# Altium schematic sheet ESP32C3_VOICE_LED_WS2812B_Sheet.SchDoc: ESP32C3_VOICE_LED
size A4; Author: Hoozz; Organization: Hoozz Play; DocumentNumber: 3; Revision: 1.0; SheetNumber: 3; SheetTotal: 3
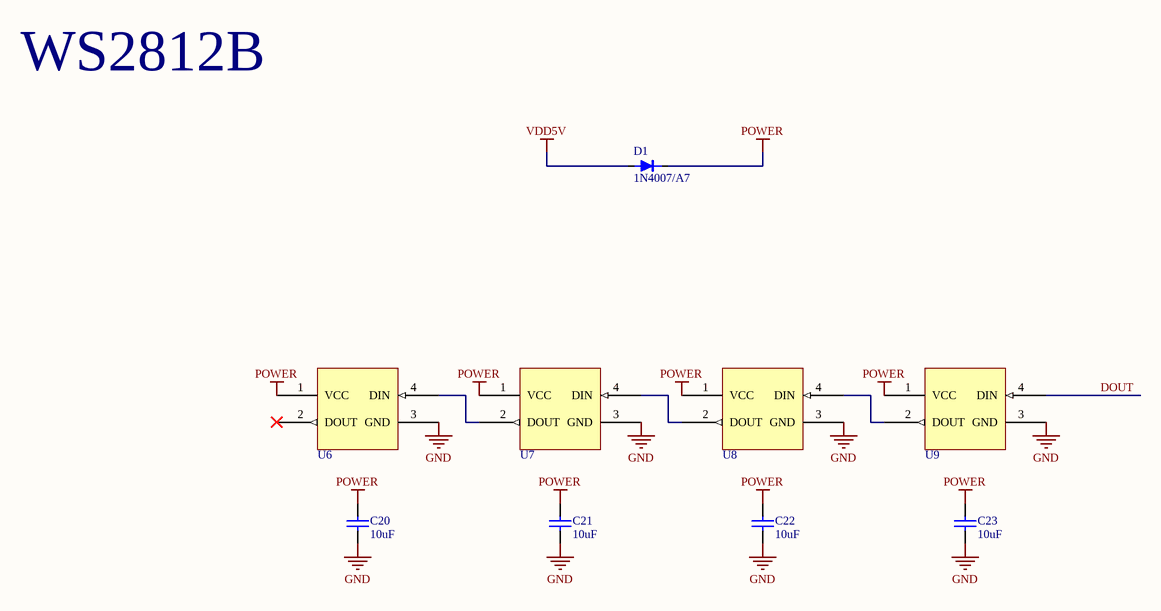
[diagram p0: ESP32C3_VOICE_LED_WS2812B_Sheet.SchDoc]

## Parts
C20  value 10uF  [0603]  (hidden comment: Cap)
C21  value 10uF  [0603]  (hidden comment: Cap)
C22  value 10uF  [0603]  (hidden comment: Cap)
C23  value 10uF  [0603]  (hidden comment: Cap)
D1  1N4007/A7  [SOD-123FL]
U6  WS2812B  [5050]  (value not drawn)
U7  WS2812B  [5050]  (value not drawn)
U8  WS2812B  [5050]  (value not drawn)
U9  WS2812B  [5050]  (value not drawn)

## Nets
GND: C20.2 C21.2 C22.2 C23.2 U6.3(GND) U7.3(GND) U8.3(GND) U9.3(GND)
POWER: C20.1 C21.1 C22.1 C23.1 D1.K U6.1(VCC) U7.1(VCC) U8.1(VCC) U9.1(VCC)
VDD5V: D1.A
DOUT: U9.4(DIN)
NetU6_4: U6.4(DIN) U7.2(DOUT)
NetU7_4: U7.4(DIN) U8.2(DOUT)
NetU8_4: U8.4(DIN) U9.2(DOUT)

Not connected (* = marked no-connect by the designer): U6 2(DOUT)*

## Notes on the sheet
- WS2812B
- Title
- Size:
- Date:
- Author:
- A4
- Number:
- Time:
- Revision:
- Sheet
- of
- File:

## Library data of the parts
C20-C23 = Cap: Capacitor; Published: 8-Jun-2000; LatestRevisionDate: 17-Jul-2002; LatestRevisionNote: Re-released for DXP Platform.; PackageReference: RAD-0.3; Publisher: Altium Limited; PackageDescription: Radial Cap, Thru-Hole; 2 Leads; 0.3 in Pin Spacing
D1 = DIODE